# Altium schematic sheet Change Log.SchDoc: Bluebell MFG PCB
size B; Author: AM; CompanyName: Cambridge Mobile Telematics; DrawnBy: A.Marles; Engineer: DM; Organization: Silver Bullet Technology; Address1: Schematic; Address2: 101 Main Street, 14th Floor; Address3: Cambridge, MA 02142; Address4: USA; DocumentNumber: BLUEBELL-POD; SheetNumber: 3; SheetTotal: 3
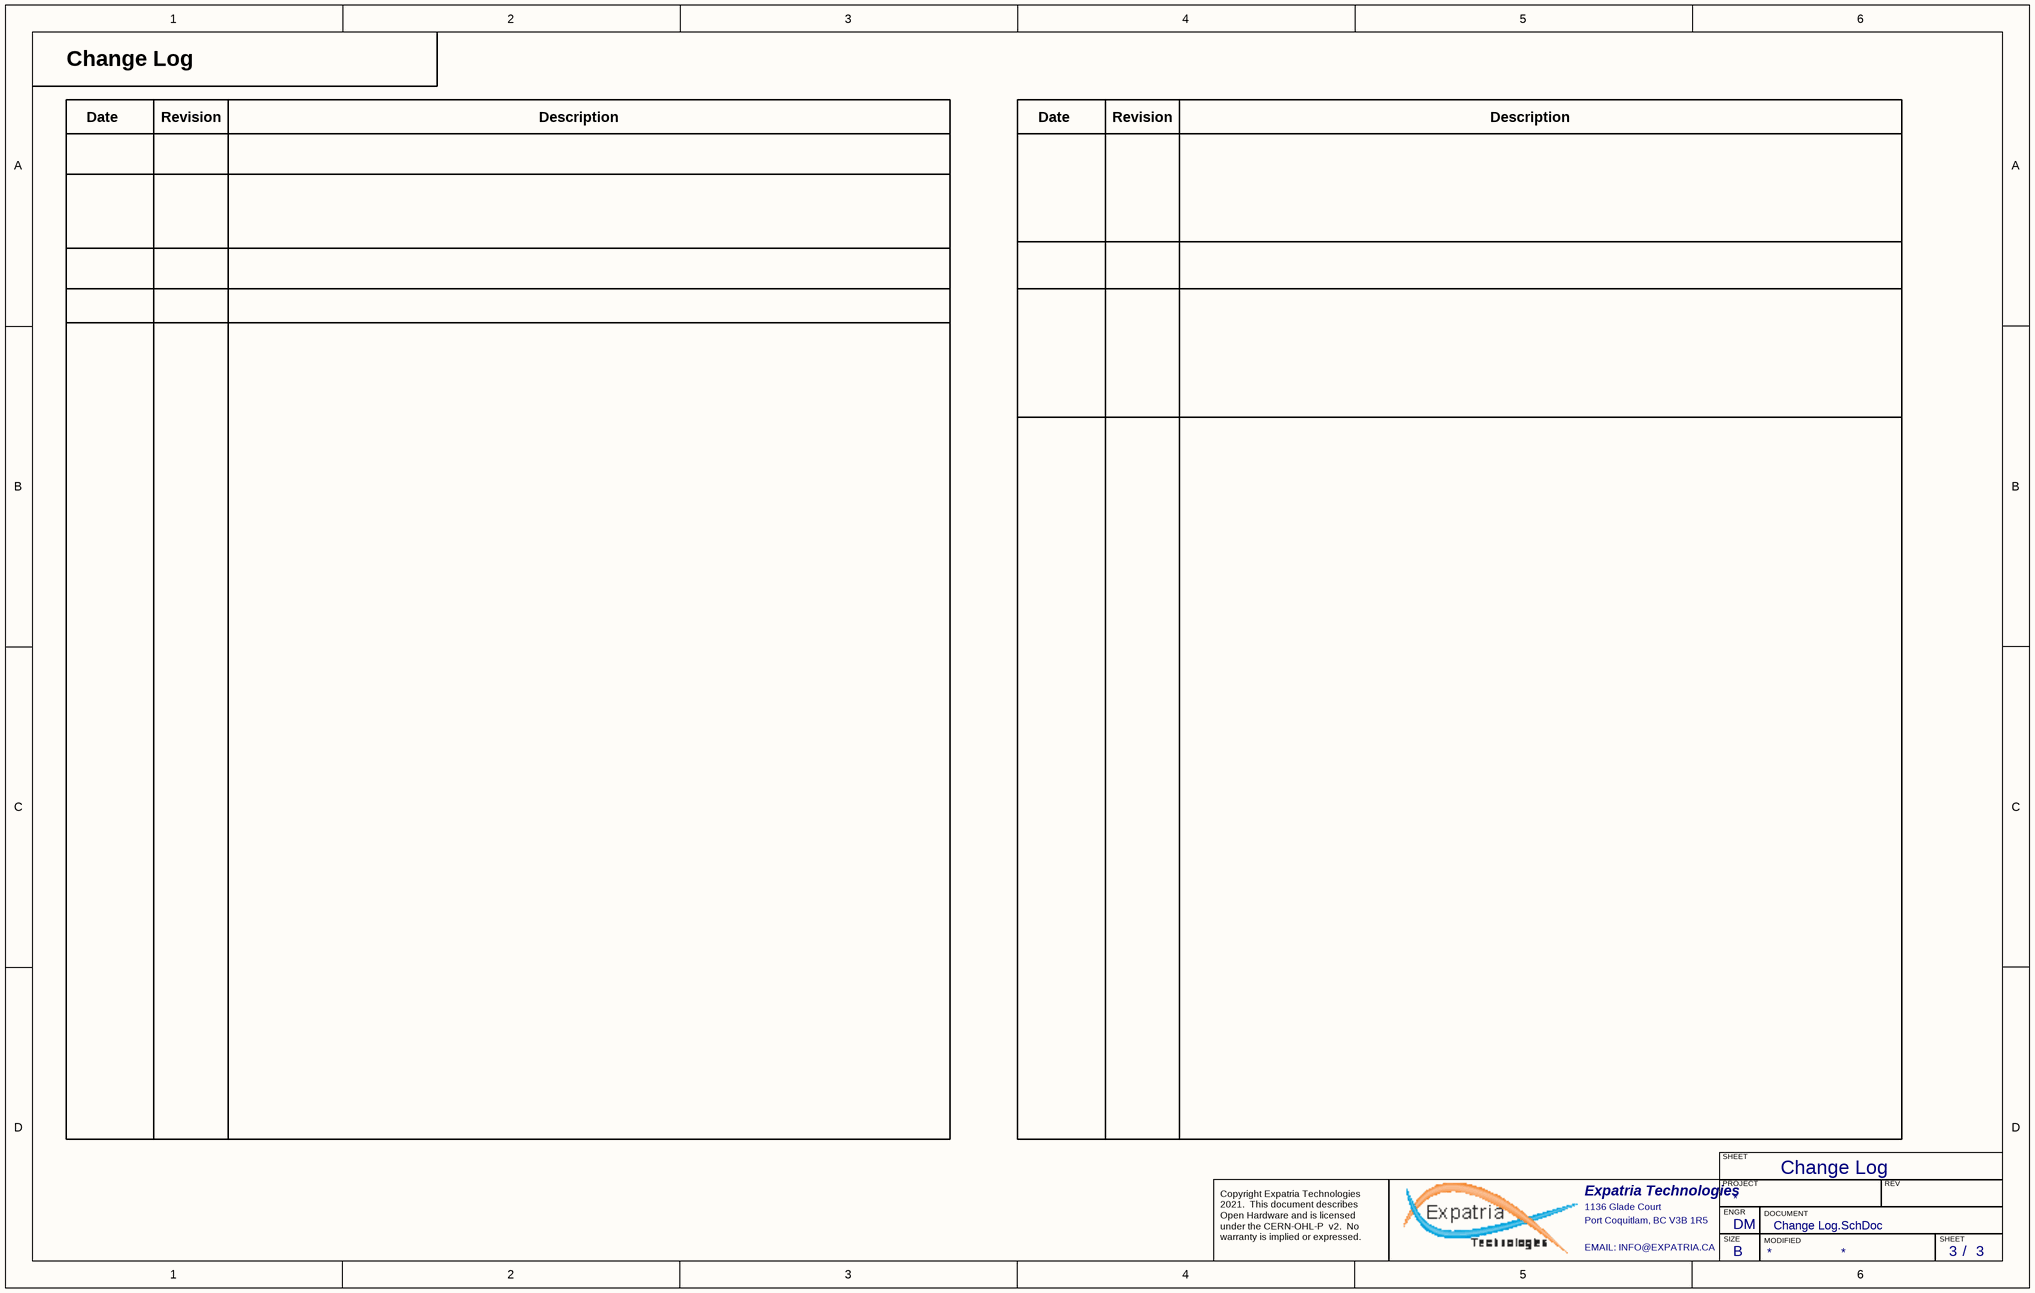
[diagram p0: Change Log.SchDoc]

## Notes on the sheet
- Change Log
- Date
- Revision
- Description
- SHEET
- Expatria Technologies
- 1136 Glade Court
- Port Coquitlam, BC V3B 1R5
- PROJECT
- SIZE
- ENGR
- MODIFIED
- DOCUMENT
- REV
- Copyright Expatria Technologies 2021.  This document describes Open Hardware and is licensed under the CERN-OHL-P  v2.  No warranty is implied or expressed.
- EMAIL: INFO@EXPATRIA.CA
- B
- /